# EAGLE design Joystick_Shield-v10 (EAGLE 6.2)
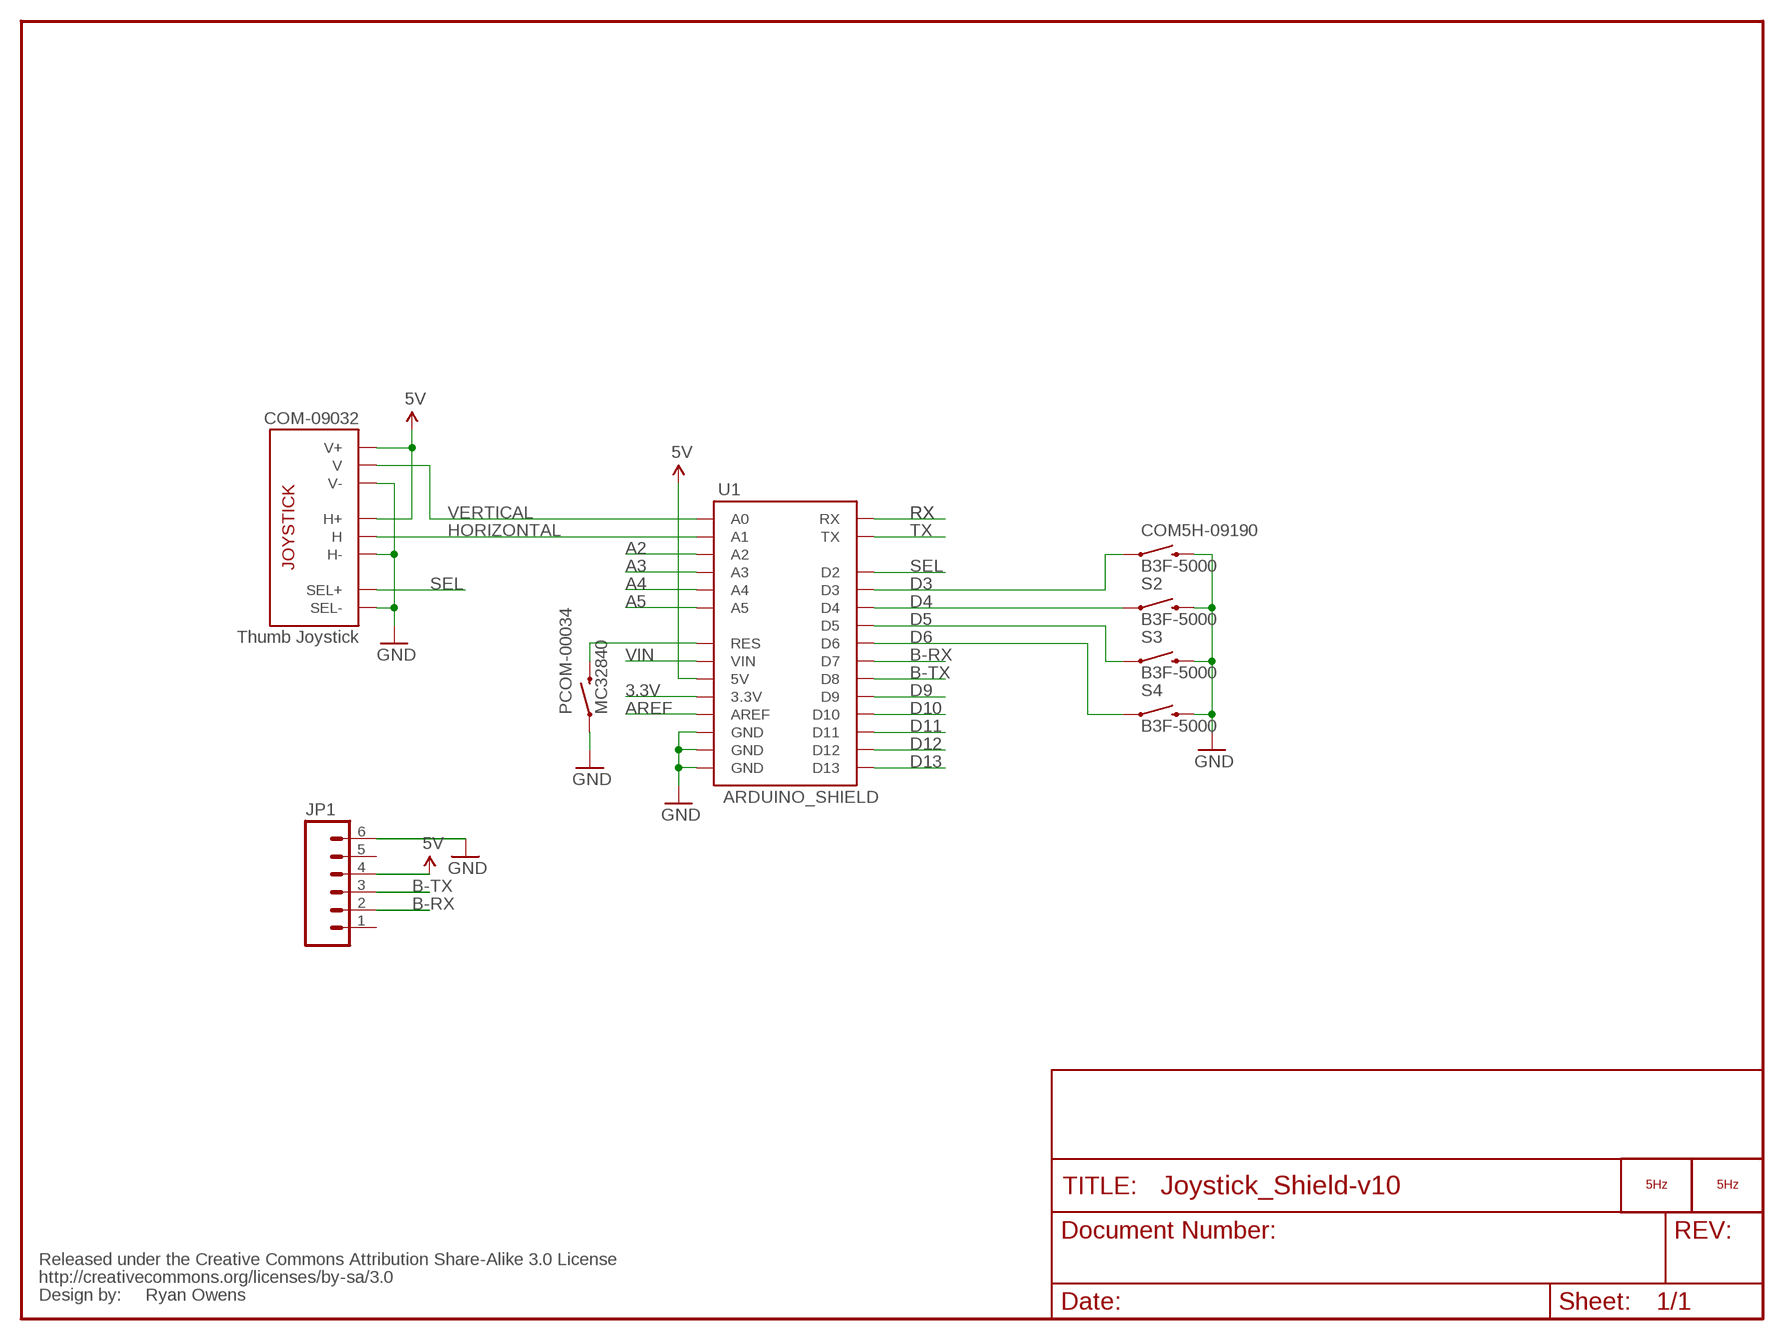
[diagram p0: schematic, sheet 1]

## Parts
COM5H-09190  B3F-5000  SWITCH-MOMENTARY-212MM  [TACTILE-PTH-12MM]
COM-09032  Thumb Joystick  JOYSTICKPTH  [JOYSTICK]
JP1  M06SIP  [1X06]
LOGO1  LOGO_5HZ_H_COOPER_15MM  [5HZ_LOGO_H_COOPER_15MM]
LOGO2  LOGO_5HZ_MAIN_15MM  [5HZ_LOGO_MAIN_15MM]
PCOM-00034  MC32840  SWITCH-MOMENTARY-2PTH  [TACTILE-PTH]
S2  B3F-5000  SWITCH-MOMENTARY-212MM  [TACTILE-PTH-12MM]
S3  B3F-5000  SWITCH-MOMENTARY-212MM  [TACTILE-PTH-12MM]
S4  B3F-5000  SWITCH-MOMENTARY-212MM  [TACTILE-PTH-12MM]
U1  ARDUINO_SHIELD  ARDUINO_SHIELDLABEL  [DUEMILANOVE_SHIELD]
U$3  CREATIVE_COMMONS  [CREATIVE_COMMONS]

## Nets
3.3V: U1.3.3V
5V: COM-09032.H1(H+) COM-09032.V1(V+) JP1.4 U1.5V
A2: U1.A2
A3: U1.A3
A4: U1.A4
A5: U1.A5
AREF: U1.AREF
B-RX: JP1.2 U1.D7
B-TX: JP1.3 U1.D8
D3: COM5H-09190.1 U1.D3
D4: S2.1 U1.D4
D5: S3.1 U1.D5
D6: S4.1 U1.D6
D9: U1.D9
D10: U1.D10
D11: U1.D11
D12: U1.D12
D13: U1.D13
GND: COM5H-09190.3 COM-09032.B2A(SEL-) COM-09032.H3(H-) COM-09032.V3(V-) JP1.6 PCOM-00034.1 S2.3 S3.3 S4.3 U1.GND@0(GND) U1.GND@1(GND) U1.GND@2(GND)
HORIZONTAL: COM-09032.H2(H) U1.A1
N$1: PCOM-00034.3 U1.RES
RX: U1.RX
SEL: COM-09032.B1A(SEL+) U1.D2
TX: U1.TX
VERTICAL: COM-09032.V2(V) U1.A0
VIN: U1.VIN
Unconnected: JP1.1 JP1.5

## Notes on the sheet
- Ryan Owens

## Library data of the parts
COM5H-09190 PCOM-00034 S2-S4 = SparkFun:SWITCH-MOMENTARY-2
COM-09032 = SparkFun:JOYSTICK: Thumb Joystick Joystick commonly found in PS2 controllers. Two pots and a select switch. Footprint proven. Spark Fun Electronics SKU : COM-09032
JP1 = SparkFun:M06: Header 6 Standard 6-pin 0.1" header. Use with straight break away headers (SKU : PRT-00116), right angle break away headers (PRT-00553), swiss pins (PRT-00743), machine pins (PRT-00117), and female headers (PRT-00115). Molex polarized connector foot print use with SKU : PRT-08094 with associated crimp pins and housings. NOTES ON THE VARIANTS LOCK and LOCK_LONGPADS... This footprint was designed to help hold the alignment of a through-hole component (i.e. 6-pin header) while soldering it into place. You may notice that each hole has been shifted either up or down by 0.005 of an inch from it's more standard position (which is a perfectly straight line). This slight alteration caused the pins (the squares in the middle) to touch the edges of the holes. Because they are alternating, it causes a "brace" to hold the component in place. 0.005 has proven to be the perfect amount of "off-center" position when using our standard breakaway headers. Although looks a little odd when you look at the bare footprint, once you have a header in there, the alteration is very hard to notice. Also, if you push a header all the way into place, it is covered up entirely on the bottom side. This idea of altering the position of holes to aid alignment will be further integrated into the Sparkfun Library for other footprints. It can help hold any component with 3 or more connection pins.
LOGO1 LOGO2 = 5hz-electronica:LOGO_5HZ: Logotipo 5Hz "según Pedro"
U1 = SparkFun:ARDUINO_SHIELD
U$3 = SparkFun:CREATIVE_COMMONS

## Board
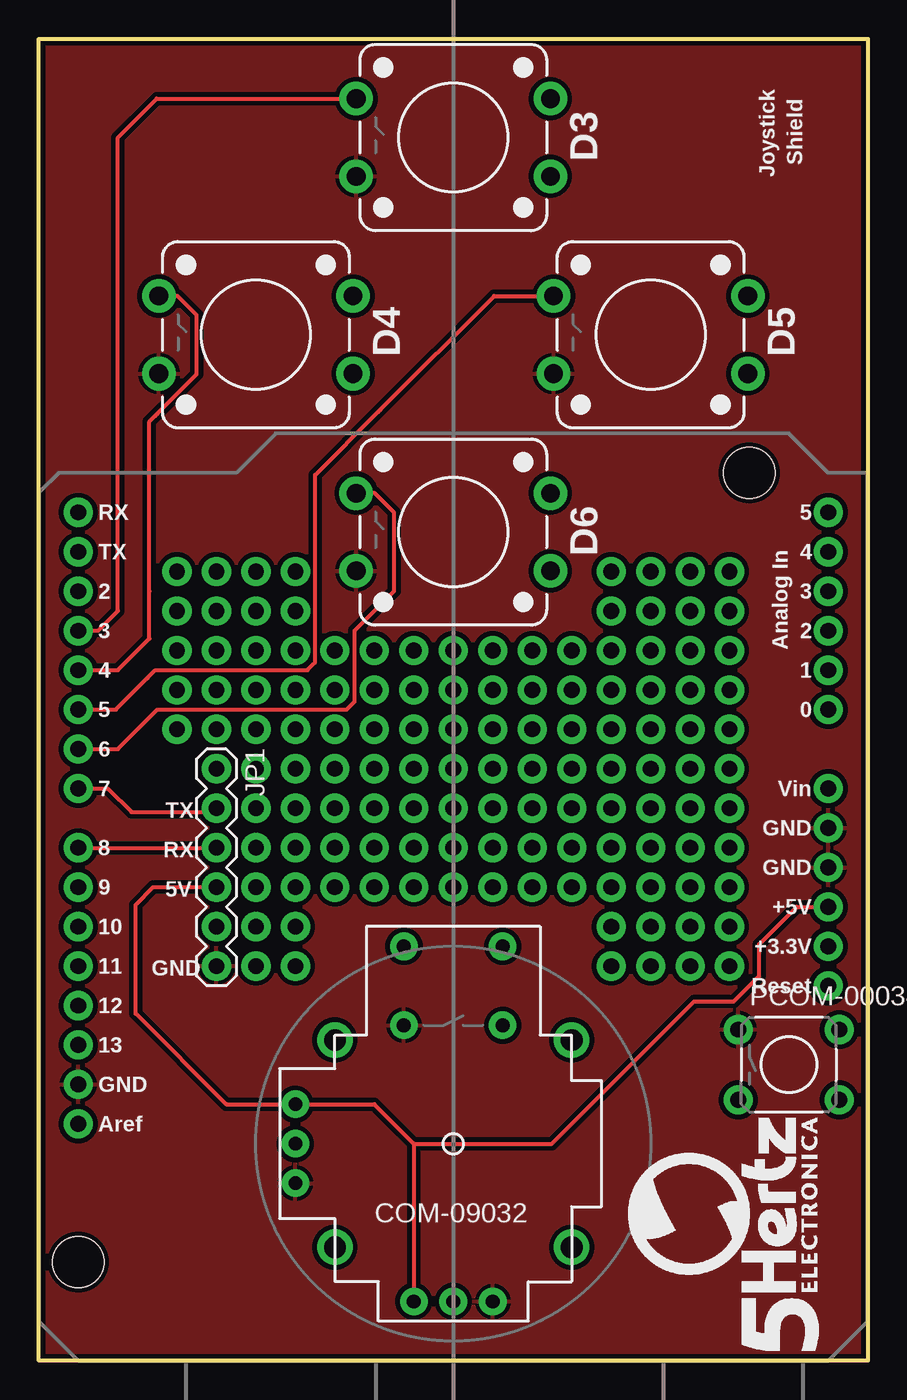
[diagram p1: board, top side]
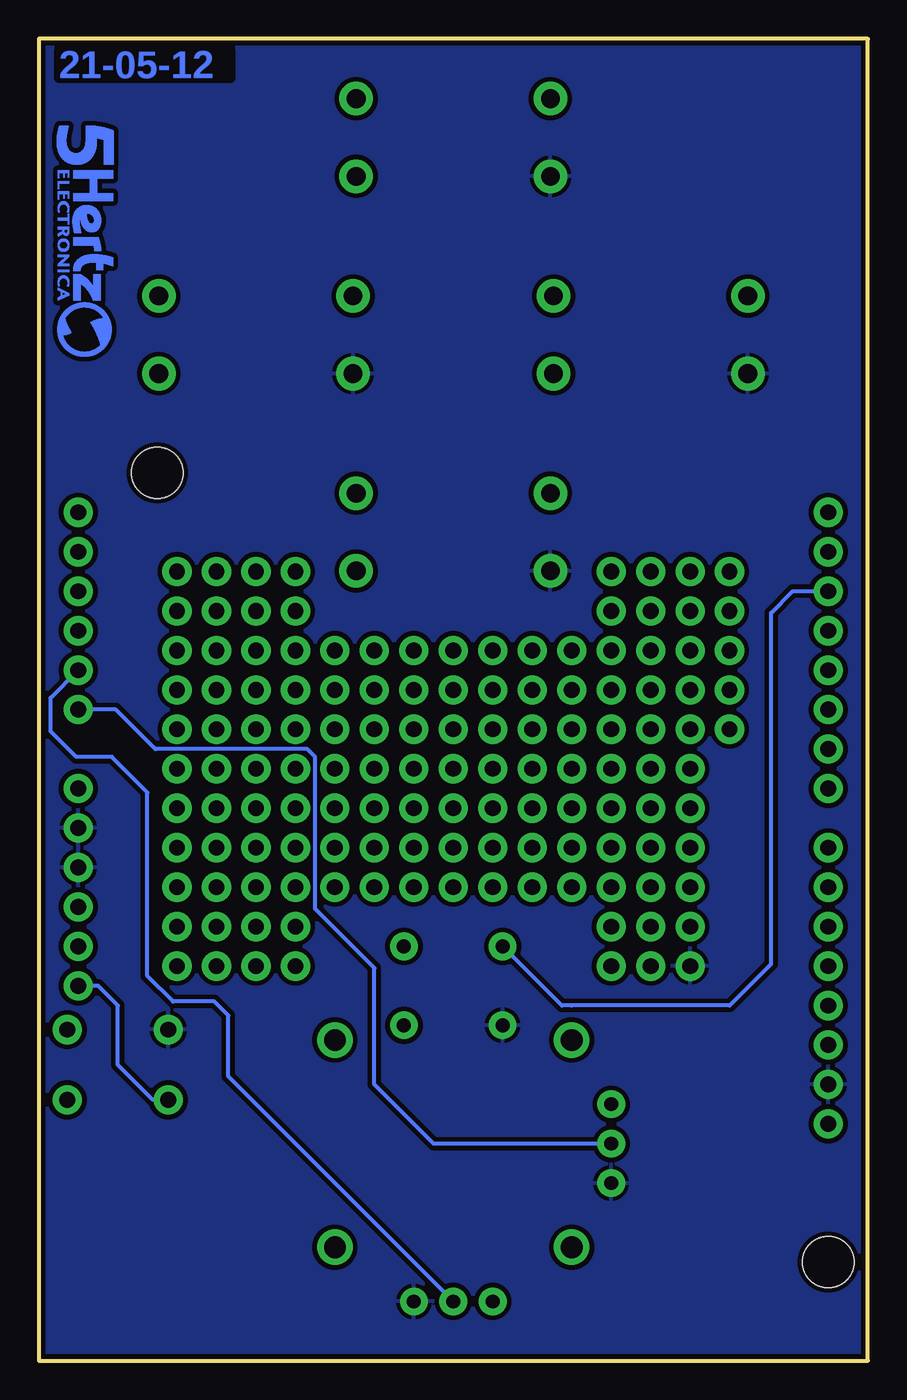
[diagram p2: board, bottom side, seen from below]

Size 53.34 x 85.09 mm. Coordinates in mm from the lower left corner, seen from the top.
Outline: 0,0 0,85.09 53.34,85.09 53.34,0 0,0
Copper layers (1*16): Top 0.035mm / dielectric 1.5mm / Bottom 0.035mm
Design rules: minimum track width 8mil, minimum drill 20mil, track to track 8mil, track to pad 8mil, pad to pad 8mil, via to via 8mil, smd to smd 8mil, copper to edge 9mil, drill to drill 8mil, minimum pad ring 12mil, minimum via ring 10mil, stop-mask expansion 4mil, vias tented up to drill 20mil, thermal gap 10mil

### Footprints (pad centres in the part's own frame; a part is rotated, then mirrored left to right if it is on the bottom)
TACTILE-PTH-12MM = drill 1.2 pad 2.159: 1 6.25,-2.5; 2 -6.25,-2.5; 3 6.25,2.5; 4 -6.25,2.5
JOYSTICK = drill 0.9 pad 1.778: B1A -3.175,12.7; B1B 3.175,12.7; B2A -3.175,7.62; B2B 3.175,7.62 | drill 0.889 pad 1.778: H1 -2.54,-10.16; H2 0,-10.16; H3 2.54,-10.16; V1 -10.16,2.54; V2 -10.16,0; V3 -10.16,-2.54 | drill 1.397 pad 2.286: MOUNT1 -7.62,6.668; MOUNT2 -7.62,-6.668; MOUNT3 7.62,-6.668; MOUNT4 7.62,6.668
1X06 = drill 1.016 pad 1.88: 1 0,0; 2 2.54,0; 3 5.08,0; 4 7.62,0; 5 10.16,0; 6 12.7,0
TACTILE-PTH = drill 1.016 pad 1.88: 1 -3.251,2.261; 2 3.251,2.261; 3 -3.251,-2.261; 4 3.251,-2.261
DUEMILANOVE_SHIELD = drill 1.016 pad 1.88: 3.3V 50.8,26.67; 5V 50.8,29.21; A0 50.8,41.91; A1 50.8,44.45; A2 50.8,46.99; A3 50.8,49.53; A4 50.8,52.07; A5 50.8,54.61; AREF 2.54,15.24; D2 2.54,49.53; D3 2.54,46.99; D4 2.54,44.45; D5 2.54,41.91; D6 2.54,39.37; D7 2.54,36.83; D8 2.54,33.02; D9 2.54,30.48; D10 2.54,27.94; D11 2.54,25.4; D12 2.54,22.86; D13 2.54,20.32; GND@0 50.8,31.75; GND@1 50.8,34.29; GND@2 2.54,17.78; RES 50.8,24.13; RX 2.54,54.61; TX 2.54,52.07; VIN 50.8,36.83 | hole 3.302: 45.72,57.15; 2.54,6.35

### Placement (x,y rotation side)
COM5H-09190  26.67,78.74 180 top
COM-09032  26.67,13.97 0 top
JP1  11.43,38.1 270 top
LOGO1  52.2,79.5 270 bottom
LOGO2  50.16,0.64 90 top
PCOM-00034  48.26,19.05 0 top
S2  13.97,66.04 180 top
S3  39.37,66.04 180 top
S4  26.67,53.34 180 top
U1  0,0 0 top
U$3  20.32,-24.13 0 top  (outside the outline)

### Tracks (layer width: path | path; a pad name or v marks a point on that pad's centre or on a via)
5V
  Top 0.254: 24.13,13.97 21.59,16.51 COM-09032.V1 12.07,16.51 6.22,22.35 6.22,29.34 7.37,30.48 JP1.4 | 24.13,13.97 COM-09032.H1 | 24.13,13.97 33.02,13.97 42.16,23.11 44.7,23.11 46.35,24.77 46.35,26.8 48.77,29.21 U1.5V
B-RX
  Top 0.254: U1.D7 4.45,36.83 5.97,35.31 11.18,35.31 JP1.2
B-TX
  Top 0.254: U1.D8 JP1.3
D3
  Top 0.254: U1.D3 3.81,46.99 5.08,48.26 5.08,78.74 7.58,81.24 COM5H-09190.1
D4
  Top 0.254: U1.D4 5.08,44.45 7.11,46.48 7.11,49.53 7.11,60.45 7.49,60.83 7.62,60.96 10.16,63.5 10.16,67.31 8.93,68.54 S2.1
D5
  Top 0.254: U1.D5 4.95,41.91 6.99,43.94 7.49,44.45 8.51,44.45 17.27,44.45 17.65,44.83 17.78,44.96 17.78,45.72 17.78,57.02 21.84,61.09 21.97,61.21 29.3,68.54 S3.1
D6
  Top 0.254: U1.D6 5.08,39.37 7.62,41.91 19.81,41.91 20.32,42.42 20.32,46.99 22.86,49.53 22.86,54.61 21.63,55.84 S4.1
GND
  pour Top (isolate 0.305): 0,0 53.34,0 53.34,85.09 0,85.09
  pour Bottom (isolate 0.305): 0,0 53.34,0 53.34,85.09 0,85.09
HORIZONTAL
  Bottom 0.254: COM-09032.H2 41.15,18.29 41.15,22.23 42.04,23.11 44.7,23.11 46.35,24.77 | U1.A1 52.58,42.67 52.58,40.51 50.93,38.86 49.4,38.86 48.64,38.86 46.35,36.58 | 46.35,24.77 46.35,36.58 | 46.35,24.77 46.35,36.58 | 46.35,24.77 46.35,36.58
N$1
  Bottom 0.254: U1.RES 49.53,24.13 48.26,22.86 48.26,19.05 46,16.79 PCOM-00034.3
N$2  (via drill 1.02 pad 1.88)
  other vias: 26.67,30.48
N$5  (via drill 1.02 pad 1.88)
  other vias: 26.67,33.02
N$6  (via drill 1.02 pad 1.88)
  other vias: 26.67,35.56
N$7  (via drill 1.02 pad 1.88)
  other vias: 26.67,38.1
N$8  (via drill 1.02 pad 1.88)
  other vias: 26.67,40.64
N$9  (via drill 1.02 pad 1.88)
  other vias: 26.67,43.18
N$10  (via drill 1.02 pad 1.88)
  other vias: 26.67,45.72
N$11  (via drill 1.02 pad 1.88)
  other vias: 29.21,30.48
N$12  (via drill 1.02 pad 1.88)
  other vias: 29.21,33.02
N$13  (via drill 1.02 pad 1.88)
  other vias: 29.21,35.56
N$14  (via drill 1.02 pad 1.88)
  other vias: 29.21,38.1
N$15  (via drill 1.02 pad 1.88)
  other vias: 29.21,40.64
N$16  (via drill 1.02 pad 1.88)
  other vias: 29.21,43.18
N$17  (via drill 1.02 pad 1.88)
  other vias: 29.21,45.72
N$18  (via drill 1.02 pad 1.88)
  other vias: 31.75,45.72
N$19  (via drill 1.02 pad 1.88)
  other vias: 31.75,43.18
N$20  (via drill 1.02 pad 1.88)
  other vias: 31.75,40.64
N$21  (via drill 1.02 pad 1.88)
  other vias: 31.75,38.1
N$22  (via drill 1.02 pad 1.88)
  other vias: 31.75,35.56
N$23  (via drill 1.02 pad 1.88)
  other vias: 31.75,33.02
N$24  (via drill 1.02 pad 1.88)
  other vias: 31.75,30.48
N$25  (via drill 1.02 pad 1.88)
  other vias: 34.29,30.48
N$26  (via drill 1.02 pad 1.88)
  other vias: 34.29,33.02
N$27  (via drill 1.02 pad 1.88)
  other vias: 34.29,35.56
N$28  (via drill 1.02 pad 1.88)
  other vias: 34.29,38.1
N$29  (via drill 1.02 pad 1.88)
  other vias: 34.29,40.64
N$30  (via drill 1.02 pad 1.88)
  other vias: 34.29,43.18
N$31  (via drill 1.02 pad 1.88)
  other vias: 34.29,45.72
N$32  (via drill 1.02 pad 1.88)
  other vias: 36.83,30.48
N$33  (via drill 1.02 pad 1.88)
  other vias: 36.83,33.02
N$34  (via drill 1.02 pad 1.88)
  other vias: 36.83,35.56
N$35  (via drill 1.02 pad 1.88)
  other vias: 36.83,38.1
N$36  (via drill 1.02 pad 1.88)
  other vias: 36.83,40.64
N$37  (via drill 1.02 pad 1.88)
  other vias: 36.83,43.18
N$38  (via drill 1.02 pad 1.88)
  other vias: 36.83,45.72
N$39  (via drill 1.02 pad 1.88)
  other vias: 39.37,45.72
N$40  (via drill 1.02 pad 1.88)
  other vias: 39.37,43.18
N$41  (via drill 1.02 pad 1.88)
  other vias: 39.37,40.64
N$42  (via drill 1.02 pad 1.88)
  other vias: 39.37,38.1
N$43  (via drill 1.02 pad 1.88)
  other vias: 39.37,35.56
N$44  (via drill 1.02 pad 1.88)
  other vias: 39.37,33.02
N$45  (via drill 1.02 pad 1.88)
  other vias: 39.37,30.48
N$46  (via drill 1.02 pad 1.88)
  other vias: 24.13,30.48
N$47  (via drill 1.02 pad 1.88)
  other vias: 24.13,33.02
N$48  (via drill 1.02 pad 1.88)
  other vias: 24.13,35.56
N$49  (via drill 1.02 pad 1.88)
  other vias: 24.13,38.1
N$50  (via drill 1.02 pad 1.88)
  other vias: 24.13,40.64
N$51  (via drill 1.02 pad 1.88)
  other vias: 24.13,43.18
N$52  (via drill 1.02 pad 1.88)
  other vias: 24.13,45.72
N$53  (via drill 1.02 pad 1.88)
  other vias: 21.59,45.72
N$54  (via drill 1.02 pad 1.88)
  other vias: 21.59,43.18
N$55  (via drill 1.02 pad 1.88)
  other vias: 21.59,38.1
N$56  (via drill 1.02 pad 1.88)
  other vias: 21.59,35.56
N$57  (via drill 1.02 pad 1.88)
  other vias: 21.59,33.02
N$58  (via drill 1.02 pad 1.88)
  other vias: 21.59,30.48
N$59  (via drill 1.02 pad 1.88)
  other vias: 19.05,30.48
N$60  (via drill 1.02 pad 1.88)
  other vias: 19.05,33.02
N$61  (via drill 1.02 pad 1.88)
  other vias: 19.05,35.56
N$62  (via drill 1.02 pad 1.88)
  other vias: 19.05,38.1
N$63  (via drill 1.02 pad 1.88)
  other vias: 19.05,40.64
N$64  (via drill 1.02 pad 1.88)
  other vias: 19.05,45.72
N$65  (via drill 1.02 pad 1.88)
  other vias: 16.51,43.18
N$66  (via drill 1.02 pad 1.88)
  other vias: 16.51,40.64
N$67  (via drill 1.02 pad 1.88)
  other vias: 16.51,38.1
N$68  (via drill 1.02 pad 1.88)
  other vias: 16.51,35.56
N$69  (via drill 1.02 pad 1.88)
  other vias: 16.51,33.02
N$70  (via drill 1.02 pad 1.88)
  other vias: 16.51,30.48
N$71  (via drill 1.02 pad 1.88)
  other vias: 41.91,30.48
N$72  (via drill 1.02 pad 1.88)
  other vias: 41.91,33.02
N$73  (via drill 1.02 pad 1.88)
  other vias: 41.91,35.56
N$74  (via drill 1.02 pad 1.88)
  other vias: 41.91,38.1
N$75  (via drill 1.02 pad 1.88)
  other vias: 41.91,40.64
N$76  (via drill 1.02 pad 1.88)
  other vias: 41.91,43.18
N$77  (via drill 1.02 pad 1.88)
  other vias: 41.91,45.72
N$78  (via drill 1.02 pad 1.88)
  other vias: 44.45,45.72
N$79  (via drill 1.02 pad 1.88)
  other vias: 44.45,43.18
N$80  (via drill 1.02 pad 1.88)
  other vias: 44.45,40.64
N$81  (via drill 1.02 pad 1.88)
  other vias: 13.97,30.48
N$82  (via drill 1.02 pad 1.88)
  other vias: 13.97,33.02
N$83  (via drill 1.02 pad 1.88)
  other vias: 13.97,35.56
N$84  (via drill 1.02 pad 1.88)
  other vias: 13.97,38.1
N$85  (via drill 1.02 pad 1.88)
  other vias: 13.97,40.64
N$86  (via drill 1.02 pad 1.88)
  other vias: 13.97,43.18
N$87  (via drill 1.02 pad 1.88)
  other vias: 13.97,45.72
N$88  (via drill 1.02 pad 1.88)
  other vias: 11.43,45.72
N$89  (via drill 1.02 pad 1.88)
  other vias: 11.43,40.64
N$98  (via drill 1.02 pad 1.88)
  other vias: 8.89,43.18
N$99  (via drill 1.02 pad 1.88)
  other vias: 8.89,45.72
N$100  (via drill 1.02 pad 1.88)
  other vias: 8.89,48.26
N$101  (via drill 1.02 pad 1.88)
  other vias: 11.43,48.26
N$102  (via drill 1.02 pad 1.88)
  other vias: 16.51,48.26
N$105  (via drill 1.02 pad 1.88)
  other vias: 13.97,27.94
N$106  (via drill 1.02 pad 1.88)
  other vias: 16.51,27.94
N$107  (via drill 1.02 pad 1.88)
  other vias: 16.51,25.4
N$108  (via drill 1.02 pad 1.88)
  other vias: 13.97,25.4
N$111  (via drill 1.02 pad 1.88)
  other vias: 8.89,50.8
N$112  (via drill 1.02 pad 1.88)
  other vias: 16.51,50.8
N$113  (via drill 1.02 pad 1.88)
  other vias: 36.83,25.4
N$114  (via drill 1.02 pad 1.88)
  other vias: 39.37,25.4
N$115  (via drill 1.02 pad 1.88)
  other vias: 41.91,25.4
N$116  (via drill 1.02 pad 1.88)
  other vias: 41.91,27.94
N$117  (via drill 1.02 pad 1.88)
  other vias: 39.37,27.94
N$118  (via drill 1.02 pad 1.88)
  other vias: 36.83,27.94
N$119  (via drill 1.02 pad 1.88)
  other vias: 36.83,48.26
N$120  (via drill 1.02 pad 1.88)
  other vias: 39.37,48.26
N$121  (via drill 1.02 pad 1.88)
  other vias: 41.91,48.26
N$122  (via drill 1.02 pad 1.88)
  other vias: 44.45,48.26
N$123  (via drill 1.02 pad 1.88)
  other vias: 44.45,50.8
N$124  (via drill 1.02 pad 1.88)
  other vias: 41.91,50.8
N$125  (via drill 1.02 pad 1.88)
  other vias: 39.37,50.8
N$126  (via drill 1.02 pad 1.88)
  other vias: 36.83,50.8
N$127  (via drill 1.02 pad 1.88)
  other vias: 11.43,50.8
N$128  (via drill 1.02 pad 1.88)
  other vias: 13.97,50.8
N$129  (via drill 1.02 pad 1.88)
  other vias: 13.97,48.26
N$130  (via drill 1.02 pad 1.88)
  other vias: 16.51,45.72
N$131  (via drill 1.02 pad 1.88)
  other vias: 11.43,43.18
N$132  (via drill 1.02 pad 1.88)
  other vias: 19.05,43.18
N$133  (via drill 1.02 pad 1.88)
  other vias: 21.59,40.64
N$134  (via drill 1.02 pad 1.88)
  other vias: 8.89,40.64
N$135  (via drill 1.02 pad 1.88)
  other vias: 44.45,25.4
N$136  (via drill 1.02 pad 1.88)
  other vias: 44.45,27.94
N$137  (via drill 1.02 pad 1.88)
  other vias: 44.45,30.48
N$138  (via drill 1.02 pad 1.88)
  other vias: 44.45,33.02
N$139  (via drill 1.02 pad 1.88)
  other vias: 44.45,35.56
N$140  (via drill 1.02 pad 1.88)
  other vias: 44.45,38.1
SEL
  Bottom 0.254: U1.D2 4.83,49.53 6.22,48.13 6.22,25.53 8.89,22.86 19.05,22.86 19.68,22.86 COM-09032.B1A
VERTICAL
  Bottom 0.254: COM-09032.V2 27.94,13.97 31.75,17.78 31.75,25.27 35.43,28.96 35.56,29.08 35.56,31.37 35.56,38.86 36.07,39.37 45.85,39.37 48.13,41.66 48.26,41.78 48.39,41.91 U1.A0

### Text on the board
Bottom: 21-05-12
tPlace: D3 | Shield | Joystick | D4 | D5 | D6 | TX | RX | 5V | GND
tValues: Ryan Owens